# EAGLE design dust_sensor (EAGLE 8.3.1)
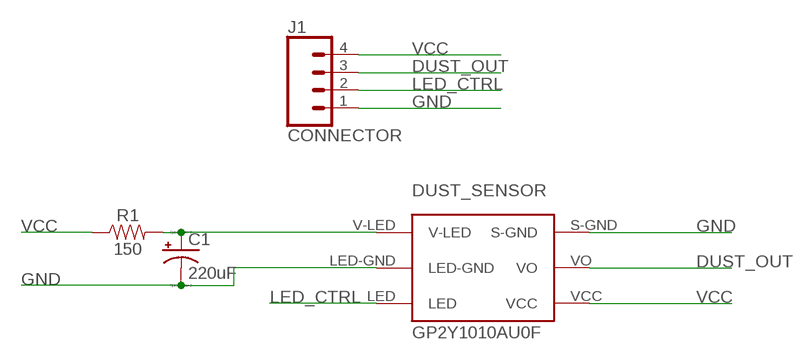
[diagram p0: schematic, sheet 1]

## Parts
C1  220uF  CPOL-USE2.5-6  [E2,5-6]
DUST_SENSOR  GP2Y1010AU0F  [GP2Y1010AU0F]
J1  CONNECTOR  CONN_04POLAR  [MOLEX-1X4]
R1  150  100OHM-HORIZ-1/4W-1%  [AXIAL-0.3]

## Nets
DUST_OUT: DUST_SENSOR.VO J1.3
GND: C1.- DUST_SENSOR.LED-GND DUST_SENSOR.S-GND J1.1
LED_CTRL: DUST_SENSOR.LED J1.2
N$1: C1.+ DUST_SENSOR.V-LED R1.P$2
VCC: DUST_SENSOR.VCC J1.4 R1.P$1

## Library data of the parts
C1 = resistor:CPOL-US: POLARIZED CAPACITOR, American symbol
DUST_SENSOR = parts:GP2Y1010AU0F
J1 = SparkFun-Connectors:CONN_04: Multi connection point. Often used as Generic Header-pin footprint for 0.1 inch spaced/style header connections On any of the 0.1 inch spaced packages, you can populate with these: Break Away Headers - Straight <https://www.sparkfun.com/products/116> (PRT-00116) Break Away Male Headers - Right Angle <https://www.sparkfun.com/products/553> (PRT-00553) Female Headers <https://www.sparkfun.com/products/115> (PRT-00115) Break Away Headers - Machine Pin <https://www.sparkfun.com/products/117> (PRT-00117) Break Away Female Headers - Swiss Machine Pin <https://www.sparkfun.com/products/743> (PRT-00743) For SCREWTERMINALS and SPRING TERMINALS visit here: Screw Terimnals on SparkFun.com <https://www.sparkfun.com/search/results?term=Screw+Terminals> (5mm/3.5mm/2.54mm spacing) This device is also useful as a general connection point to wire up your design to another part of your project. Our various solder wires solder well into these plated through hole pads. Hook-Up Wire - Assortment (Stranded, 22 AWG) <https://www.sparkfun.com/products/11375> (PRT-11375) Hook-Up Wire - Assortment (Solid Core, 22 AWG) <https://www.sparkfun.com/products/11367> (PRT-11367) View the entire wire category on our website here <https://www.sparkfun.com/categories/141> Special notes: Molex polarized connector foot print use with SKU : PRT-08231 with associated crimp pins and housings. 1MM SMD Version SKU: PRT-10208; PROD_ID: CONN-08186; SF_ID: PRT-08231
R1 = SparkFun-Resistors:100OHM: 100Ω resistor A resistor is a passive two-terminal electrical component that implements electrical resistance as a circuit element. Resistors act to reduce current flow, and, at the same time, act to lower voltage levels within circuits. - Wikipedia; PROD_ID: RES-12181; VALUE: 100

## Board
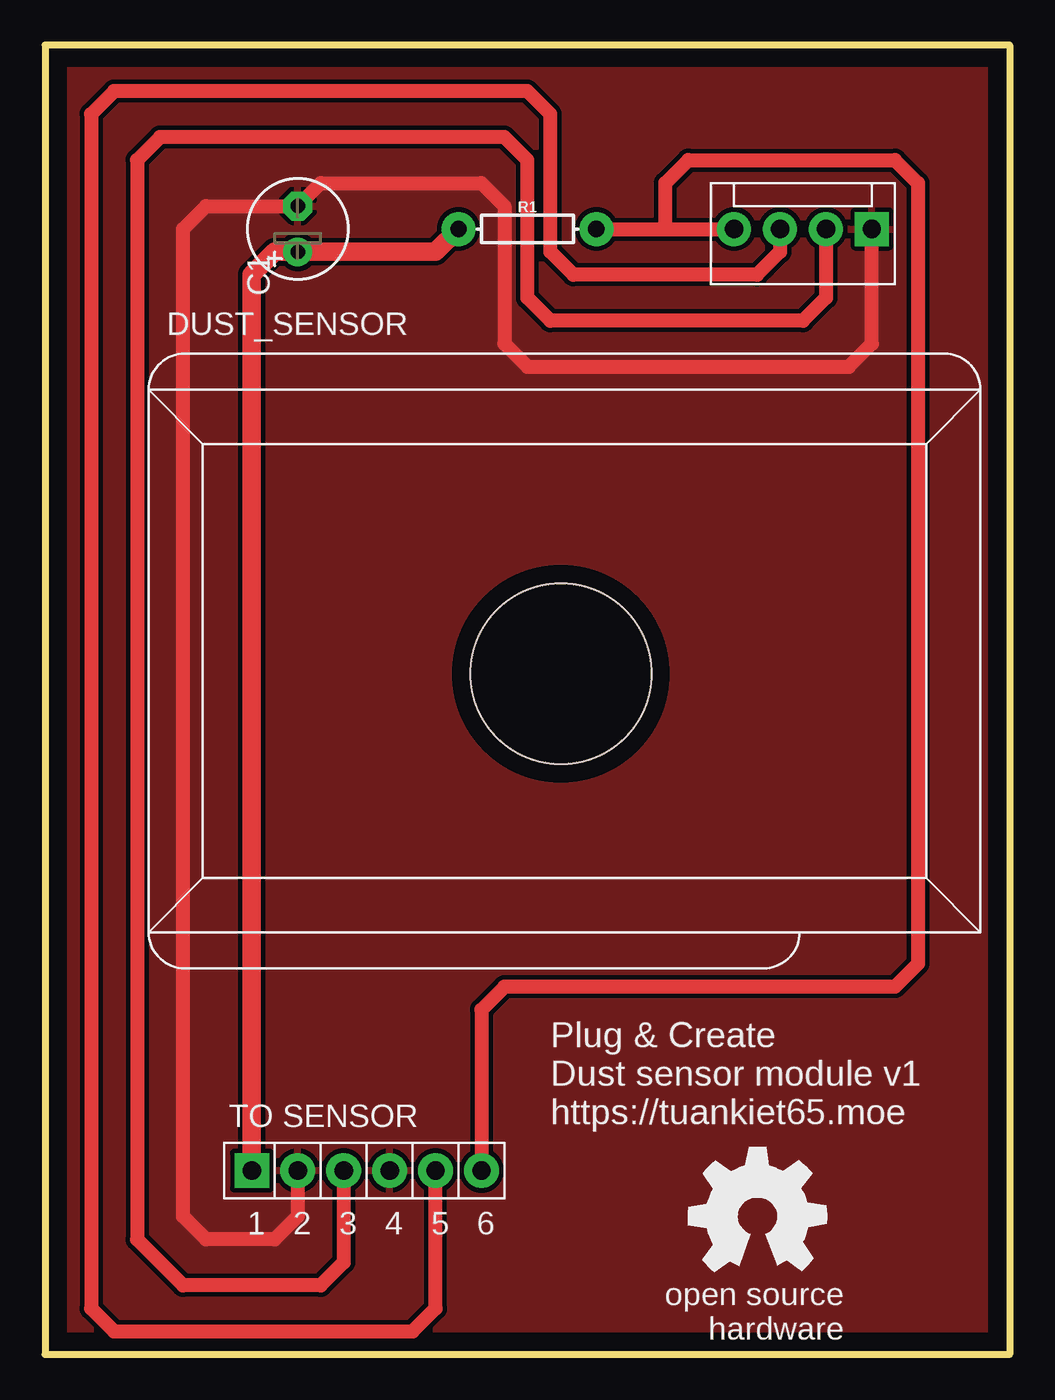
[diagram p1: board, top side]

Size 53.34 x 72.39 mm. Coordinates in mm from the lower left corner, seen from the top.
Outline: 53.34,72.39 53.34,0 0,0 0,72.39 53.34,72.39
Copper layers (1*16): Top 0.035mm / dielectric 1.5mm / Bottom 0.035mm
Design rules "default *": minimum track width 6mil, minimum drill 0.35mm, track to track 6mil, track to pad 6mil, pad to pad 6mil, via to via 6mil, smd to smd 6mil, copper to edge 40mil, drill to drill 6mil, minimum pad ring 10mil, minimum via ring 8mil, stop-mask expansion 4mil, vias tented up to drill 0mil, thermal gap 10mil

### Footprints (pad centres in the part's own frame; a part is rotated, then mirrored left to right if it is on the bottom)
E2,5-6 = drill 0.813 pad 1.6: + -1.27,0 | drill 0.813 pad 1.6 octagon: - 1.27,0
GP2Y1010AU0F = drill 1.016 pad 1.93: LED -29.21,-43.18; LED-GND -31.75,-43.18; S-GND -26.67,-43.18; VCC -21.59,-43.18; VO -24.13,-43.18 | drill 1.016 pad 1.93 square: V-LED -34.29,-43.18 | hole 10: -17.2,-15.7
MOLEX-1X4 = drill 1.016 pad 1.88 square: 1 0,0 | drill 1.016 pad 1.88: 2 2.54,0; 3 5.08,0; 4 7.62,0
AXIAL-0.3 = drill 0.9 pad 1.88: P$1 -3.81,0; P$2 3.81,0

### Placement (x,y rotation side)
C1  13.97,62.23 90 top
DUST_SENSOR  45.72,53.34 0 top
J1  45.72,62.23 180 top
R1  26.67,62.23 180 top
U$1  [OSHW_8MM]  39.37,7.62 0 top

### Tracks (layer width: path | path; a pad name or v marks a point on that pad's centre or on a via)
DUST_OUT
  Top 0.762: DUST_SENSOR.VO 21.59,2.54 20.32,1.27 3.81,1.27 2.54,2.54 2.54,68.58 3.81,69.85 26.67,69.85 27.94,68.58 27.94,60.96 29.21,59.69 39.37,59.69 40.64,60.96 J1.3
GND
  Top 0.762: DUST_SENSOR.LED-GND 13.97,7.62 12.7,6.35 8.89,6.35 7.62,7.62 7.62,62.23 8.89,63.5 C1.- 15.24,64.77 24.13,64.77 25.4,63.5 25.4,55.88 26.67,54.61 44.45,54.61 45.72,55.88 J1.1
  pour Top (isolate 0.254): 0,0 53.34,0 53.34,72.39 0,72.39
LED_CTRL
  Top 0.762: DUST_SENSOR.LED 16.51,5.08 15.24,3.81 7.62,3.81 5.08,6.35 5.08,66.04 6.35,67.31 25.4,67.31 26.67,66.04 26.67,58.42 27.94,57.15 41.91,57.15 43.18,58.42 J1.2
N$1
  Top 1.016: R1.P$2 21.59,60.96 C1.+ 12.7,60.96 11.43,59.69 DUST_SENSOR.V-LED
VCC
  Top 0.762: R1.P$1 34.29,62.23 | 34.29,62.23 J1.4 | 34.29,62.23 34.29,64.77 35.56,66.04 46.99,66.04 48.26,64.77 48.26,21.59 46.99,20.32 25.4,20.32 24.13,19.05 DUST_SENSOR.VCC

### Text on the board
tPlace: Plug & Create / Dust sensor module v1 / https://tuankiet65.moe